# Altium project STM32F722PCB-THESIS.PrjPcb
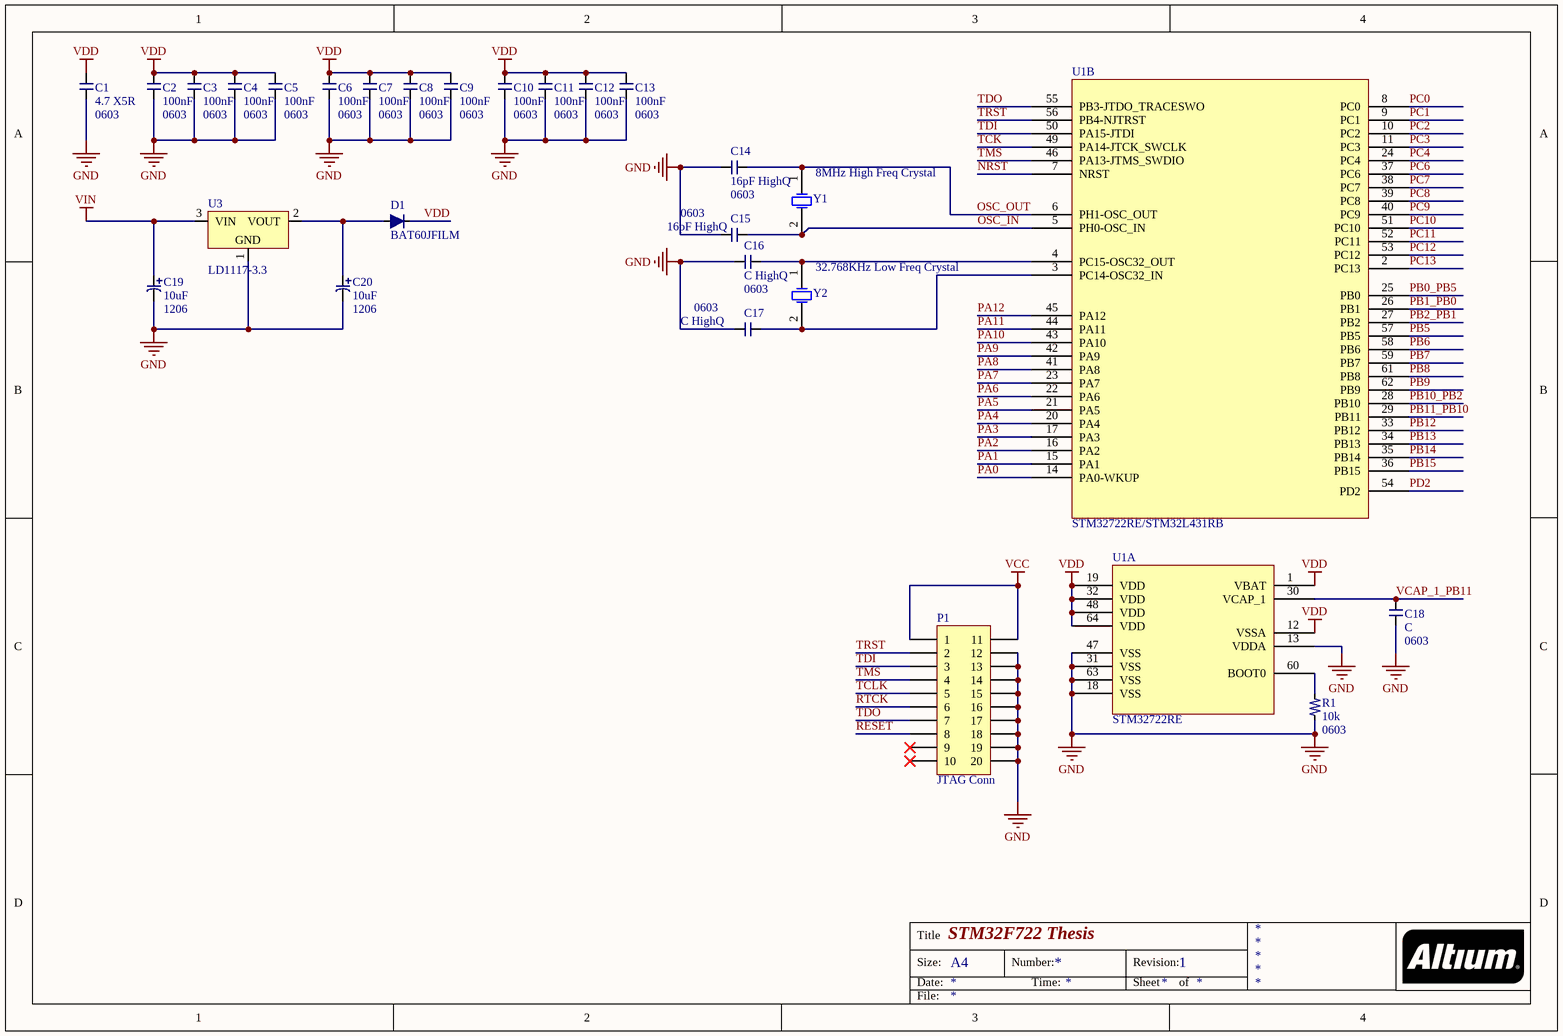
[diagram p0: STM32F7.SchDoc]
1 sheet, 27 parts. Net scope: global (net labels, ports and power ports of the same name join across sheets).

## Sheet STM32F7.SchDoc: STM32F722 Thesis
size A4; DrawnBy: GORAGOD P; Revision: 1

### Parts
C1  4.7 X5R  [Chip 0603C]
C2  100nF  [Chip 0603C]
C3  100nF  [Chip 0603C]
C4  100nF  [Chip 0603C]
C5  100nF  [Chip 0603C]
C6  100nF  [Chip 0603C]
C7  100nF  [Chip 0603C]
C8  100nF  [Chip 0603C]
C9  100nF  [Chip 0603C]
C10  100nF  [Chip 0603C]
C11  100nF  [Chip 0603C]
C12  100nF  [Chip 0603C]
C13  100nF  [Chip 0603C]
C14  16pF HighQ  [Chip 0603C]
C15  16pF HighQ  [Chip 0603C]
C16  C HighQ  [Chip 0603C]
C17  C HighQ  [Chip 0603C]
C18  C  [Chip 0603C]
C19  10uF  [Chip Tan 1206]
C20  10uF  [Chip Tan 1206]
D1  BAT60JFILM  [SOD323]
P1  JTAG Conn  [HDR2X10_CEN]
R1  10k  [Chip 0603R]
U1  STM32722RE  [STM32F722RE-FP]  (parts A,B of 2)
U3  LD1117-3.3  [SOT-223]
Y1  8MHz High Freq Crystal  [R38]
Y2  32.768KHz Low Freq Crystal  [R38]

### Nets
GND: C1.1 C2.1 C3.1 C4.1 C5.1 C6.1 C7.1 C8.1 C9.1 C10.1 C11.1 C12.1 C13.1 C14.1 C15.1 C16.1 C17.1 C18.1 C19.2 C20.2 P1.12 P1.13 P1.14 P1.15 P1.16 P1.17 P1.18 P1.19 P1.20 R1.1 U1.13(VDDA) U1.18(VSS) U1.31(VSS) U1.47(VSS) U1.63(VSS) U3.1(GND)
VCC: P1.1 P1.11
VDD: C1.2 C2.2 C3.2 C4.2 C5.2 C6.2 C7.2 C8.2 C9.2 C10.2 C11.2 C12.2 C13.2 D1.2 U1.1(VBAT) U1.12(VSSA) U1.19(VDD) U1.32(VDD) U1.48(VDD) U1.64(VDD)
VIN: C19.1 U3.3(VIN)
NRST: U1.7(NRST)
OSC_IN: C15.2 U1.5(PH0-OSC_IN) Y1.2(OSC2)
OSC_OUT: C14.2 U1.6(PH1-OSC_OUT) Y1.1(OSC1)
PA0: U1.14(PA0-WKUP)
PA1: U1.15(PA1)
PA2: U1.16(PA2)
PA3: U1.17(PA3)
PA4: U1.20(PA4)
PA5: U1.21(PA5)
PA6: U1.22(PA6)
PA7: U1.23(PA7)
PA8: U1.41(PA8)
PA9: U1.42(PA9)
PA10: U1.43(PA10)
PA11: U1.44(PA11)
PA12: U1.45(PA12)
PB0_PB5: U1.25(PB0)
PB1_PB0: U1.26(PB1)
PB2_PB1: U1.27(PB2)
PB5: U1.57(PB5)
PB6: U1.58(PB6)
PB7: U1.59(PB7)
PB8: U1.61(PB8)
PB9: U1.62(PB9)
PB10_PB2: U1.28(PB10)
PB11_PB10: U1.29(PB11)
PB12: U1.33(PB12)
PB13: U1.34(PB13)
PB14: U1.35(PB14)
PB15: U1.36(PB15)
PC0: U1.8(PC0)
PC1: U1.9(PC1)
PC2: U1.10(PC2)
PC3: U1.11(PC3)
PC4: U1.24(PC4)
PC6: U1.37(PC6)
PC7: U1.38(PC7)
PC8: U1.39(PC8)
PC9: U1.40(PC9)
PC10: U1.51(PC10)
PC11: U1.52(PC11)
PC12: U1.53(PC12)
PC13: U1.2(PC13)
PD2: U1.54(PD2)
RESET: P1.8
RTCK: P1.6
TCK: U1.49(PA14-JTCK_SWCLK)
TCLK: P1.5
TDI: P1.3 U1.50(PA15-JTDI)
TDO: P1.7 U1.55(PB3-JTDO_TRACESWO)
TMS: P1.4 U1.46(PA13-JTMS_SWDIO)
TRST: P1.2 U1.56(PB4-NJTRST)
VCAP_1_PB11: C18.2 U1.30(VCAP_1)
NetC16_2: C16.2 U1.4(PC15-OSC32_OUT) Y2.1(OSC1)
NetC17_2: C17.2 U1.3(PC14-OSC32_IN) Y2.2(OSC2)
NetC20_1: C20.1 D1.1 U3.2(VOUT)
NetR1_2: R1.2 U1.60(BOOT0)

Not connected (* = marked no-connect by the designer): P1 9* 10*

### Notes on the sheet
- Title
- Size:
- Date:
- A4
- Number:
- Time:
- Revision:
- Sheet
- of
- File:
- (in symbol 0603-C) 0603
- (in symbol 0603-R) 0603
- (in symbol CT1206) 1206

### Library data of the parts
C1-C18 = 0603-C
C19 C20 = CT1206
P1 = Header 10X2A: Header, 10-Pin, Dual row; LatestRevisionDate: 17-Jul-2002; LatestRevisionNote: Re-released for DXP Platform.; Publisher: Altium Limited
R1 = 0603-R
U1 = STM32F722RE: Mouser Link: http://th.mouser.com/ProductDetail/STMicroelectronics/STM32F722RET6/?qs=%2fha2pyFadujfNX2SIlaQE1NoHfZniB%252b7VQgin410whUkbTeJ88RXSA%3d%3d
U3 = LD1117AS33TR: Positive Fixed Voltage Regulator LDO 3.3V/1A
Y1 Y2 = XTAL: Crystal Oscillator; Published: 8-Jun-2000; LatestRevisionDate: 17-Jul-2002; LatestRevisionNote: Re-released for DXP Platform.; PackageReference: R38; Publisher: Altium Limited; PackageDescription: Crystal, Thru-Hole; 2 Leads; Body 3.1 x 8.2 mm (Dia.xH)